# EAGLE design LPY503AL-Breakout-v1.0 (EAGLE 6.2)
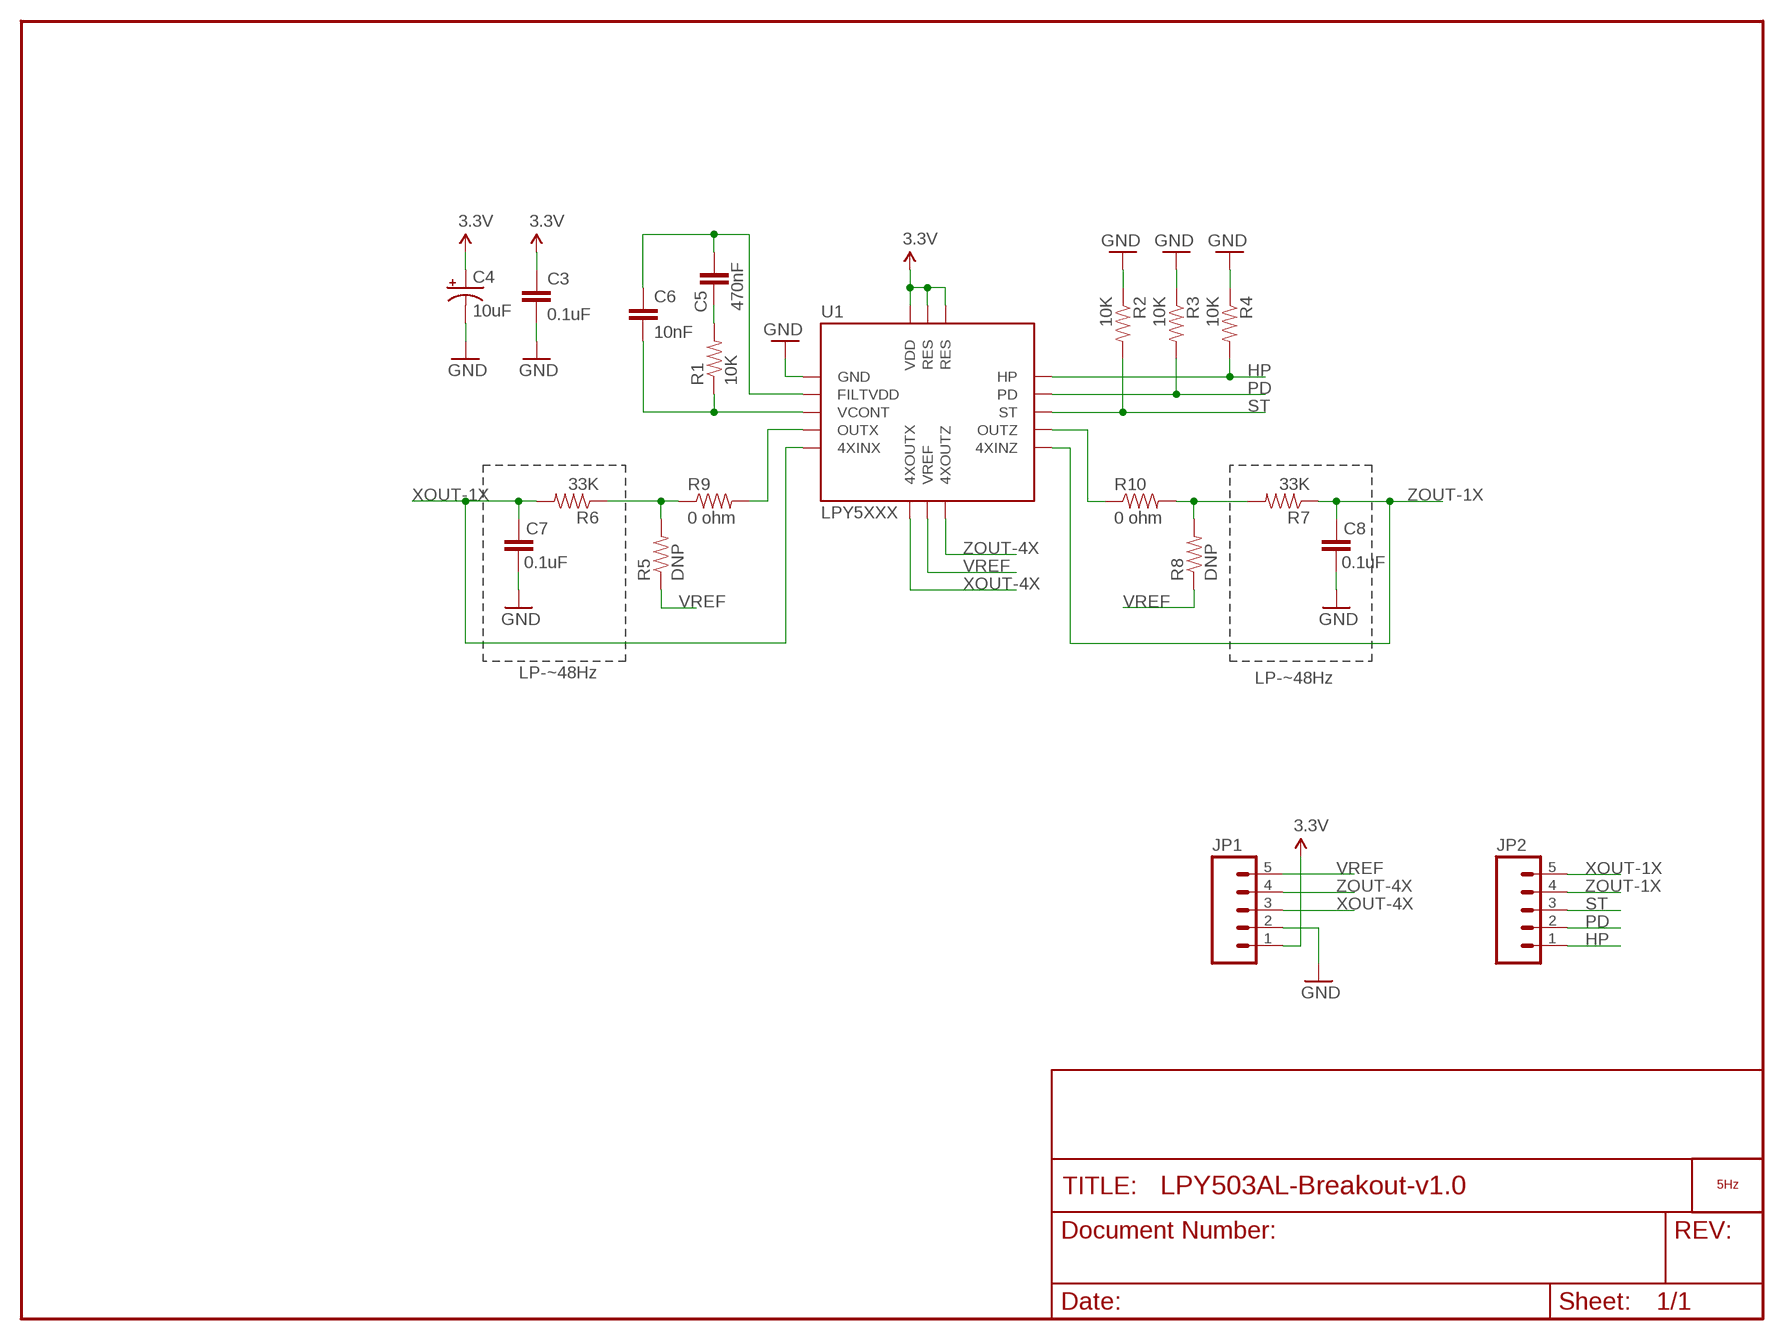
[diagram p0: schematic, sheet 1]

## Parts
C3  0.1uF  CAP0402-CAP  [0402-CAP]
C4  10uF  CAP_POL1206  [EIA3216]
C5  470nF  CAP0402-CAP  [0402-CAP]
C6  10nF  CAP0402-CAP  [0402-CAP]
C7  0.1uF  CAP0402-CAP  [0402-CAP]
C8  0.1uF  CAP0402-CAP  [0402-CAP]
JP1  M05PTH  [1X05]
JP2  M05PTH  [1X05]
LOGO1  LOGO_5HZ_MAIN_5MM  [5HZ_LOGO_MAIN_5MM]
R1  10K  RESISTOR0402-RES  [0402-RES]
R2  10K  RESISTOR0402-RES  [0402-RES]
R3  10K  RESISTOR0402-RES  [0402-RES]
R4  10K  RESISTOR0402-RES  [0402-RES]
R5  DNP  RESISTOR0402-RES  [0402-RES]
R6  33K  RESISTOR0402-RES  [0402-RES]
R7  33K  RESISTOR0402-RES  [0402-RES]
R8  DNP  RESISTOR0402-RES  [0402-RES]
R9  0 ohm  RESISTOR0402-RES  [0402-RES]
R10  0 ohm  RESISTOR0402-RES  [0402-RES]
U1  LPY5XXX  ST-GYRO-PYSMD  [ST-GYRO]

## Nets
3.3V: C3.1 C4.A(+) JP1.1 U1.14(RES) U1.15(RES) U1.16(VDD)
F1: C5.1 C6.1 U1.2(FILTVDD)
F2: C6.2 R1.1 U1.3(VCONT)
GND: C3.2 C4.C(-) C7.1 C8.1 JP1.2 R2.1 R3.1 R4.1 U1.1(GND)
HP: JP2.1 R4.2 U1.13(HP)
N$1: R9.2 U1.4(OUTX)
N$2: C5.2 R1.2
N$3: R10.1 U1.10(OUTZ)
N$4: R5.2 R6.1 R9.1
N$6: R7.2 R8.2 R10.2
PD: JP2.2 R3.2 U1.12(PD)
ST: JP2.3 R2.2 U1.11(ST)
VREF: JP1.5 R5.1 R8.1 U1.7(VREF)
XOUT-1X: C7.2 JP2.5 R6.2 U1.5(4XINX)
XOUT-4X: JP1.3 U1.6(4XOUTX)
ZOUT-1X: C8.2 JP2.4 R7.1 U1.9(4XINZ)
ZOUT-4X: JP1.4 U1.8(4XOUTZ)

## Notes on the sheet
- LP-~48Hz
- LP-~48Hz

## Library data of the parts
C3 C5-C8 = SparkFun:CAP: Capacitor Standard 0603 ceramic capacitor, and 0.1" leaded capacitor.
C4 = SparkFun:CAP_POL: Capacitor Polarized These are standard SMD and PTH capacitors. Normally 10uF, 47uF, and 100uF in electrolytic and tantalum varieties. Always verify the external diameter of the through hole cap, it varies with capacity, voltage, and manufacturer. The EIA devices should be standard.
JP1 JP2 = SparkFun:M05: Header 5 Standard 5-pin 0.1" header. Use with straight break away headers (SKU : PRT-00116), right angle break away headers (PRT-00553), swiss pins (PRT-00743), machine pins (PRT-00117), and female headers (PRT-00115). Molex polarized connector foot print use with SKU : PRT-08230 with associated crimp pins and housings.
LOGO1 = 5hz-electronica:LOGO_5HZ: Logotipo 5Hz "según Pedro"
R1-R10 = SparkFun:RESISTOR: Resistor Basic schematic elements and footprints for 0603, 1206, and PTH resistors.
U1 = SparkFun:ST-GYRO-PY

## Board
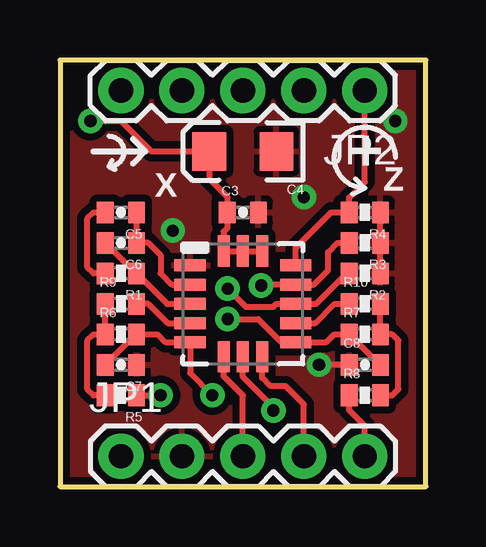
[diagram p1: board, top side]
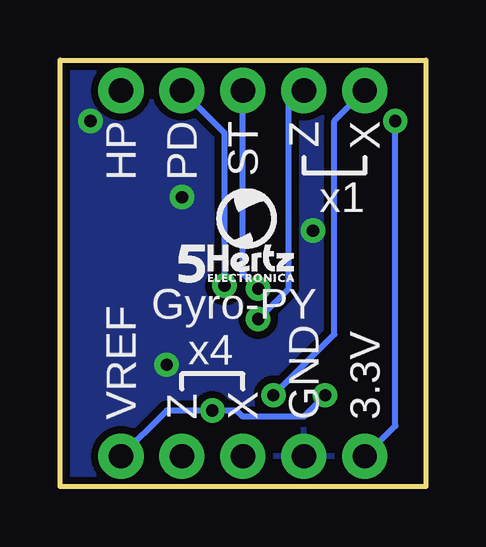
[diagram p2: board, bottom side, seen from below]

Size 15.24 x 17.78 mm. Coordinates in mm from the lower left corner, seen from the top.
Outline: 0,0 15.24,0 15.24,17.78 0,17.78 0,0
Copper layers (1*16): Top 0.035mm / dielectric 1.5mm / Bottom 0.035mm
Design rules: minimum track width 8mil, minimum drill 20mil, track to track 8mil, track to pad 8mil, pad to pad 8mil, via to via 8mil, smd to smd 8mil, copper to edge 9mil, drill to drill 8mil, minimum pad ring 12mil, minimum via ring 10mil, stop-mask expansion 4mil, vias tented up to drill 20mil, thermal gap 10mil

### Footprints (pad centres in the part's own frame; a part is rotated, then mirrored left to right if it is on the bottom)
0402-CAP = smd 0.7 x 0.9: 1 -0.65,0; 2 0.65,0
EIA3216 = smd 1.4 x 1.6: A 1.4,0; C -1.4,0
1X05 = drill 1.016 pad 1.88: 1 0,0; 2 2.54,0; 3 5.08,0; 4 7.62,0; 5 10.16,0
0402-RES = smd 0.7 x 0.9: 1 -0.65,0; 2 0.65,0
ST-GYRO = smd 1.3 x 0.5: 1 -2.2,1.6; 2 -2.2,0.8; 3 -2.2,0; 4 -2.2,-0.8; 5 -2.2,-1.6; 9 2.2,-1.6; 10 2.2,-0.8; 11 2.2,0; 12 2.2,0.8; 13 2.2,1.6 | smd 0.5 x 1.3: 6 -0.8,-2.2; 7 0,-2.2; 8 0.8,-2.2; 14 0.8,2.2; 15 0,2.2; 16 -0.8,2.2

### Placement (x,y rotation side)
C3  7.62,11.43 0 top
C4  7.62,13.97 180 top
C5  2.54,11.43 180 top
C6  2.54,10.16 180 top
C7  2.54,5.08 180 top
C8  12.7,5.08 0 top
JP1  2.54,1.27 0 top
JP2  12.7,16.51 180 top
LOGO1  10.29,8.51 0 bottom
R1  2.54,8.89 180 top
R2  12.7,8.89 180 top
R3  12.7,10.16 180 top
R4  12.7,11.43 180 top
R5  2.54,3.81 180 top
R6  2.54,6.35 0 top
R7  12.7,6.35 0 top
R8  12.7,3.81 0 top
R9  2.54,7.62 0 top
R10  12.7,7.62 0 top
U1  7.62,7.62 0 top

### Tracks (layer width: path | path; a pad name or v marks a point on that pad's centre or on a via)
3.3V  (via drill 0.51)
  Top 0.254: U1.14 U1.15 U1.16 6.82,10.63 6.97,10.78 C3.1 6.97,12.08 6.22,12.83 C4.A 3.81,13.97 2.54,15.24 v1.27,15.24
  Bottom 0.254: JP1.1 1.27,2.54 v1.27,15.24
F1
  Top 0.254: U1.2 4.66,8.42 4.19,8.89 4.19,9.65 3.68,10.16 C6.1 C5.1
F2
  Top 0.254: C6.2 3.16,8.89 R1.1 4.46,7.62 U1.3
GND  (via drill 0.51)
  Top 0.254: R2.1 R3.1 R4.1 | C8.1 v10.79,5.08
  other vias: 10.16,12.06 13.97,15.24 4.7,10.67
  pour Bottom (isolate 0.305): 0,17.78 15.24,17.78 15.24,0 0,0
  pour Top (isolate 0.305): 0,17.78 15.24,17.78 15.24,0 0,0
HP
  Top 0.254: U1.13 9.82,9.95 11.3,11.43 R4.2 12.05,12.05 12.7,12.7 JP2.1
N$1
  Top 0.254: U1.4 4.48,6.82 3.68,7.62 R9.2
N$2
  Top 0.254: C5.2 1.4,11.43 1.14,11.18 1.14,9.14 1.4,8.89 R1.2
N$3
  Top 0.254: U1.10 10.63,6.82 11.43,7.62 R10.1
N$4
  Top 0.254: R5.2 1.4,3.81 1.14,4.06 1.14,6.1 1.4,6.35 R6.1 R9.1
N$6
  Top 0.254: R8.2 13.84,3.81 14.1,4.06 14.1,6.1 13.84,6.35 R7.2 R10.2
PD  (via drill 0.51)
  Top 0.254: R3.2 11.56,10.16 11.18,9.78 11.18,9.02 10.58,8.42 U1.12 8.42,8.42 v8.38,8.38
  Bottom 0.254: v8.38,8.38 8.38,14.73 JP2.2
ST  (via drill 0.51)
  Top 0.254: R2.2 11.94,8.89 10.67,7.62 U1.11 9.02,7.62 8.89,7.49 7.75,7.49 v6.99,8.26
  Bottom 0.254: JP2.3 7.62,8.89 v6.99,8.26
VREF  (via drill 0.51)
  Top 0.254: R8.1 12.05,3.19 12.7,2.54 JP1.5 | R5.1 v4.19,3.81 | U1.7 7.62,4.57 8.89,3.3 v8.89,3.17
  Bottom 0.254: JP1.5 10.79,3.17 v8.89,3.17 7.87,3.17 7.62,2.92 5.08,2.92 v4.19,3.81
XOUT-1X  (via drill 0.51)
  Top 0.254: C7.2 3.16,6.35 R6.2 4.06,6.35 4.39,6.02 U1.5 5.42,4.74 v6.35,3.81
  Bottom 0.254: JP2.5 3.81,15.24 3.81,6.35 v6.35,3.81
XOUT-4X
  Top 0.254: U1.6 6.82,4.61 7.62,3.81 JP1.3
ZOUT-1X  (via drill 0.51)
  Top 0.254: v6.99,6.99 8.26,6.99 9.22,6.02 U1.9 11.1,6.02 11.43,6.35 R7.1 13.32,5.08 C8.2
  Bottom 0.254: JP2.4 5.71,15.88 5.71,8.26 v6.99,6.99
ZOUT-4X
  Top 0.254: U1.8 8.42,4.53 8.76,4.19 9.4,4.19 10.16,3.43 JP1.4

### Text on the board
tPlace: + | X | Z
bPlace: X | Z | ST | PD | HP | x1 | Gyro-PY | x4 | 3.3V | GND | X | Z | VREF